# EasyEDA schematic AeroModule_2021-02-14.json

## Sheets
1 Sheet_1: TITLE: Sheet_1; REV: 1.0; Date: 2020-12-30; Sheet: 1/1; Drawn By: ron; Company: Your Company
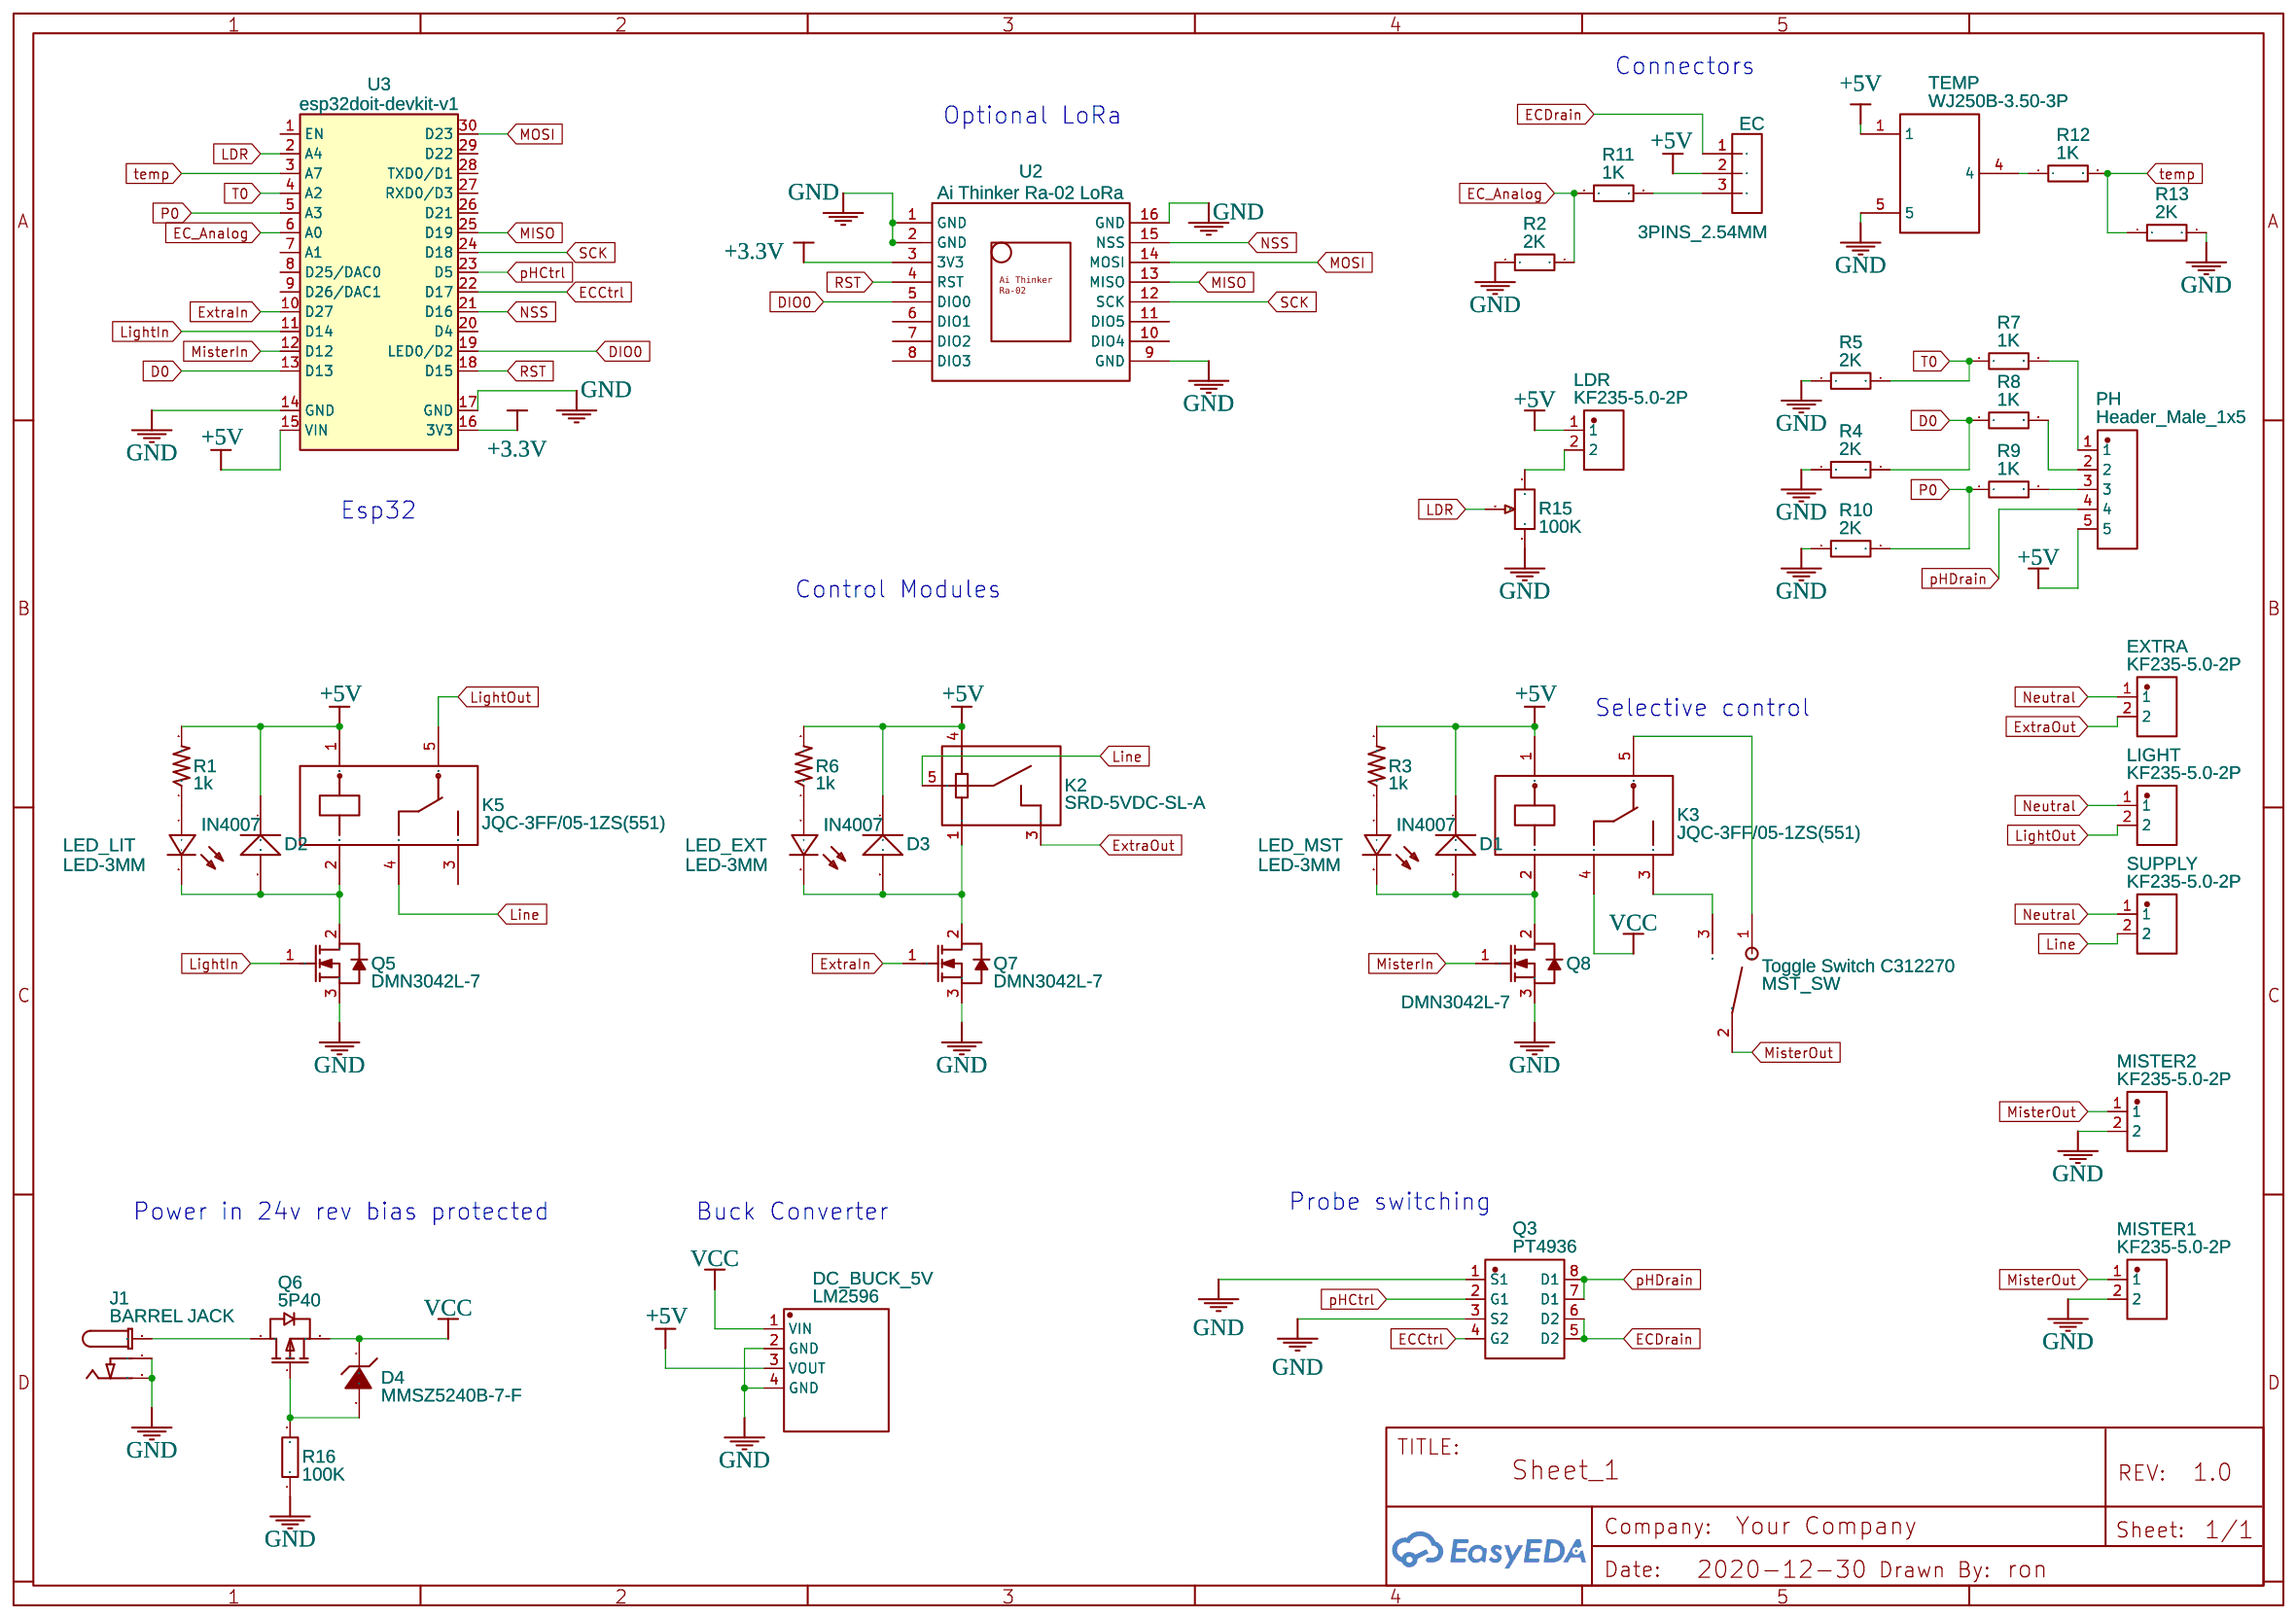
[diagram p0: Sheet_1]
2 Power: TITLE: Sheet_2; Date: 2021-02-05; Drawn By: myrods47
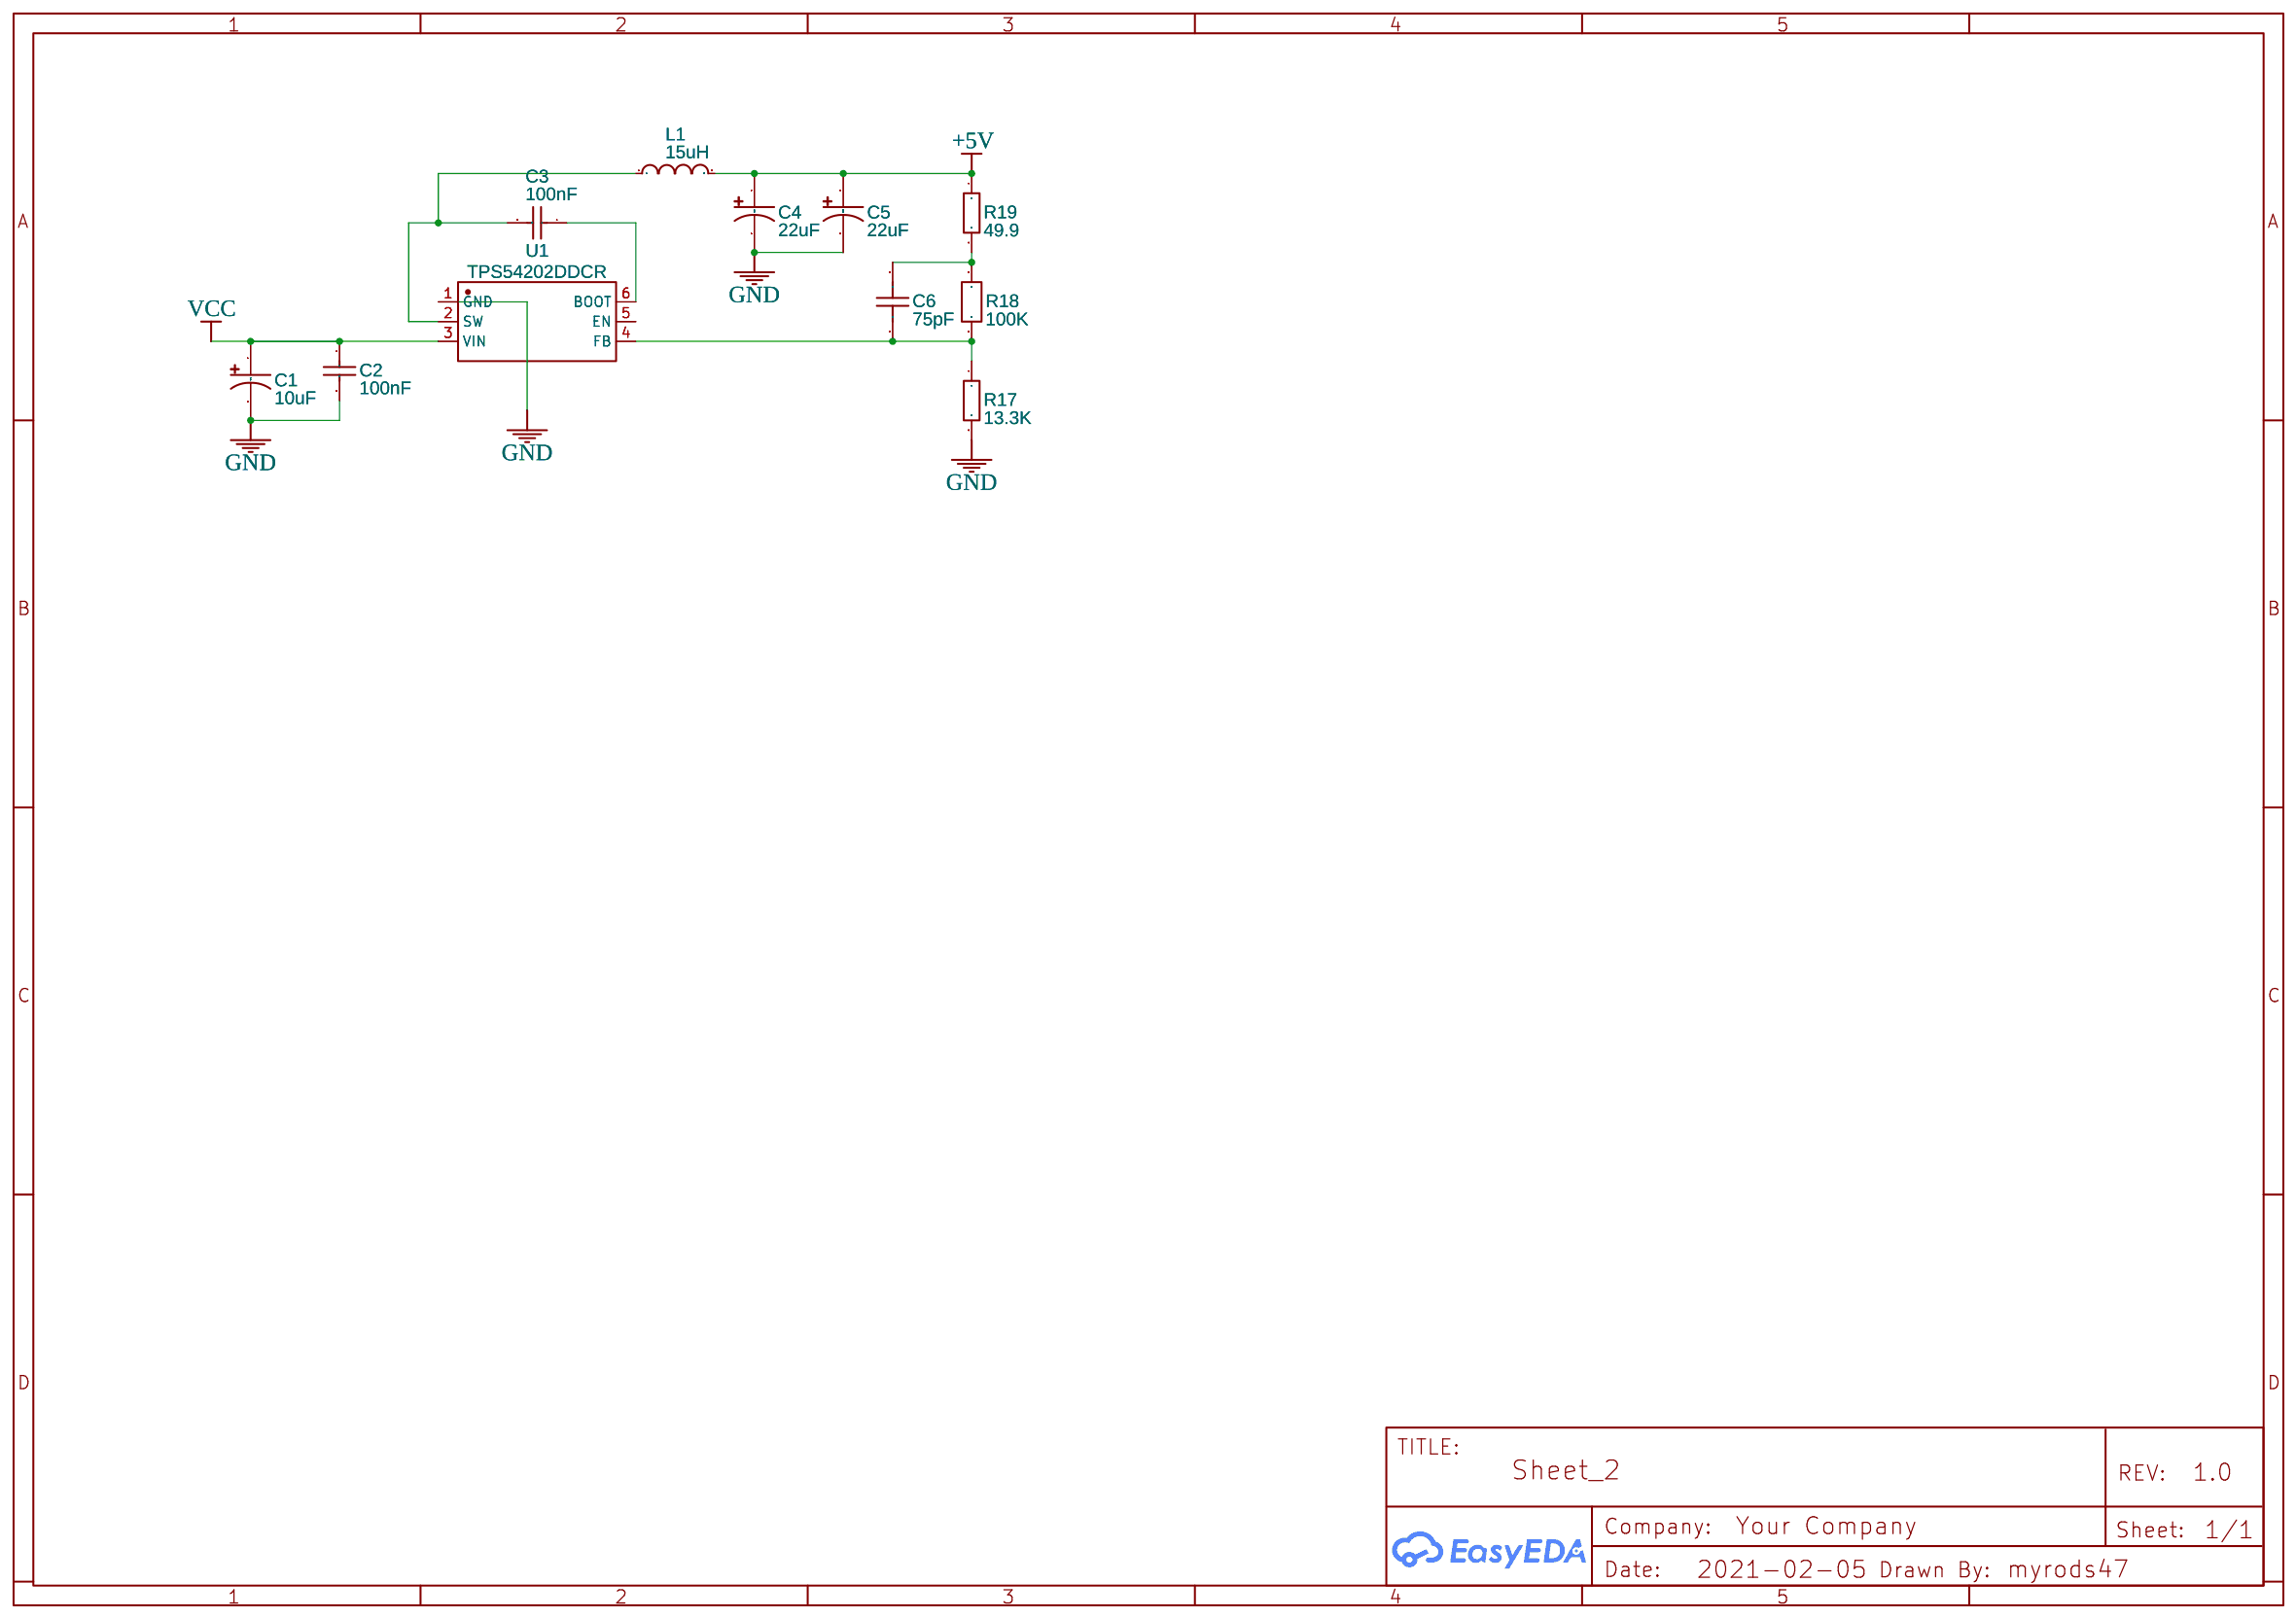
[diagram p1: Power]

## Parts
sheet Power
C1  10uF  [CAP-SMD_BD5.0-L5.3-W5.3-FD]
C2  100nF  [C1206]
C3  100nF  [C1206]
C4  22uF  [CAP-SMD_BD6.3-L6.6-W6.6-FD]
C5  22uF  [CAP-SMD_BD6.3-L6.6-W6.6-FD]
C6  75pF  [C0805]
L1  15uH  [IND-SMD_L5.0-W5.0_SWPA5040S]
R17  13.3K  [R1206]
R18  100K  [R1206]
R19  49.9  [R0805]
U1  TPS54202DDCR  [SOT-23-6_L2.9-W1.6-P0.95-LS2.8-BR]
sheet Sheet_1
D1  IN4007  [IN4007]
D2  IN4007  [IN4007]
D3  IN4007  [IN4007]
D4  MMSZ5240B-7-F  [SOD-123_L2.7-W1.6-LS3.7-RD]
DC_BUCK_5V  LM2596  [LM2596-MODULE]
EC  3PINS_2.54MM  [CONNECTOR - 3PIN]
EXTRA  KF235-5.0-2P  [CONN-TH_P5.00_KF235-5.0-2P]
J1  BARREL JACK  [DC_BARREL_JACK_PTH_2MM_2]
K2  SRD-5VDC-SL-A  [SRD-5VDC-SL-A]
K3  JQC-3FF/05-1ZS(551)  [RELAY-TH_HF3FF-XX-1ZXX-XXX]
K5  JQC-3FF/05-1ZS(551)  [RELAY-TH_HF3FF-XX-1ZXX-XXX]
LDR  KF235-5.0-2P  [CONN-TH_P5.00_KF235-5.0-2P]
LED_EXT  LED-3MM  [LED-3MM/2.54]
LED_LIT  LED-3MM  [LED-3MM/2.54]
LED_MST  LED-3MM  [LED-3MM/2.54]
LIGHT  KF235-5.0-2P  [CONN-TH_P5.00_KF235-5.0-2P]
MISTER1  KF235-5.0-2P  [CONN-TH_P5.00_KF235-5.0-2P]
MISTER2  KF235-5.0-2P  [CONN-TH_P5.00_KF235-5.0-2P]
MST_SW  Toggle Switch C312270  [TOGGLE SWITCH C312270]
PH  Header_Male_1x5  [PAD_1X5]
Q3  PT4936  [SOIC-8_L5.0-W4.0-P1.27-LS6.0-BL]
Q5  DMN3042L-7  [SOT-23-3_L2.9-W1.6-P1.90-LS2.8-BR-CW]
Q6  5P40  [SOT-23-3_L2.9-W1.6-P1.90-LS2.8-BR]
Q7  DMN3042L-7  [SOT-23-3_L2.9-W1.6-P1.90-LS2.8-BR-CW]
Q8  DMN3042L-7  [SOT-23-3_L2.9-W1.6-P1.90-LS2.8-BR-CW]
R1  1k  [1206]
R2  2K  [R1206]
R3  1k  [1206]
R4  2K  [R1206]
R5  2K  [R1206]
R6  1k  [1206]
R7  1K  [R1206]
R8  1K  [R1206]
R9  1K  [R1206]
R10  2K  [R1206]
R11  1K  [R1206]
R12  1K  [R1206]
R13  2K  [R1206]
R15  100K  [RES-ADJ-TH_3P-L9.5-W4.9-P2.50-L_3296W]
R16  100K  [R1206]
SUPPLY  KF235-5.0-2P  [CONN-TH_P5.00_KF235-5.0-2P]
TEMP  WJ250B-3.50-3P  [CONN-TH_3P-P3.50_WJ250B-3.50-3P]
U2  Ai Thinker Ra-02 LoRa  [AI THINKER RA-02 LORA]
U3  esp32doit-devkit-v1  [ESP32_DEVKIT_V1_DOIT]

## Library data of the parts
C1 = EEEHB1V100AR: Supplier: LCSC; Supplier Part: C336504; Manufacturer: PANASONIC; Contributor: LCSC
C2 C3 = CL31B104KBCNNNC: Supplier: LCSC; Manufacturer: SAMSUNG; Supplier Part: C24497; SMT Type: Basic; JLCPCB SMD: Yes; LCSC Assembly: Yes
C4 C5 = CK1V220M-CRE54: Supplier: LCSC; Supplier Part: C190079; Manufacturer: Semtech; Contributor: LCSC
C6 = CC0805JRNPO9BN750: Supplier: LCSC; Supplier Part: C113832; Manufacturer: YAGEO; Contributor: LCSC
L1 = CR5040-150M: Supplier: LCSC; Supplier Part: C520353; Manufacturer: Ceaiya; Contributor: LCSC
R17 = TR1206B13K3P0550: Supplier: LCSC; Supplier Part: C153316; Manufacturer: Ever Ohms Tech; Contributor: LCSC
R18 = TC0650F1003T5E: Supplier: LCSC; Supplier Part: C425571; Manufacturer: UNI-ROYAL(Uniroyal Elec); Contributor: LCSC
R19 = TC0525F499JT5E: Supplier: LCSC; Manufacturer: UniOhm; Supplier Part: C78599; SMT Type: Extend; JLCPCB SMD: Yes; LCSC Assembly: Yes
U1 = TPS54202DDCR: Supplier: LCSC; Supplier Part: C191884; Manufacturer: Texas Instruments; Contributor: LCSC; SMT Type: Extend; JLCPCB SMD: Yes; LCSC Assembly: Yes
D1-D3 = -: Manufacturer Part: IRFD9120PbF; Contributor: William Meade
D4 = MMSZ5240B-7-F: Supplier: LCSC; Manufacturer: DIODES; Contributor: LCSC; Supplier Part: C151060; SMT Type: Extend; JLCPCB SMD: Yes; LCSC Assembly: Yes
DC_BUCK_5V = LM2596
EC = 3PINS_2.54MM: Supplier Part: undefined; Contributor: fredj21
EXTRA LDR LIGHT MISTER1 MISTER2 SUPPLY = KF235-5.0-2P: Supplier: LCSC; Supplier Part: C475172; Manufacturer: Cixi Kefa Elec; Contributor: LCSC
J1 = BARREL JACK: Contributor: MarekB
K2 = -: Supplier: LCSC; Supplier Part: C140615; Manufacturer: Ningbo Songle Relay; Contributor: LCSC
K3 K5 = JQC-3FF/05-1ZS(551): Supplier: LCSC; Manufacturer: HF; image: //image.lceda.cn/szlcsc/C9221.jpg; Supplier Part: C9221; LCSC Assembly: Yes; SMT Type: Extend
LED_EXT LED_LIT LED_MST = -: Supplier: LCSC; Manufacturer: EVERLIGHT; Manufacturer Part: 204-10SURD/S530-A3; Supplier Part: C99772
MST_SW = Toggle Switch C312270: Manufacturer: YUEN FUNG; Manufacturer Part: ST-1-102-A01-T000-RS; Supplier: LCSC; Supplier Part: C312270; link: https://lcsc.com/product-detail/Toggle-Switches_YUEN-FUNG-ST-1-102-A01-T000-RS_C312270.html; Contributor: danielbland
PH = Header_Male_1x5: Contributor: Max500
Q3 = PT4936: Supplier: LCSC; Supplier Part: C479040; Manufacturer: PUOLOP; Contributor: LCSC
Q5 Q7 Q8 = DMN3042L-7: Supplier: LCSC; Supplier Part: C102621; Manufacturer: Diodes Incorporated; Contributor: LCSC; SMT Type: Extend; JLCPCB SMD: Yes; LCSC Assembly: Yes
Q6 = 5P40: Supplier: LCSC; Supplier Part: C239051; Manufacturer: GOFORD; Contributor: LCSC; SMT Type: Extend; JLCPCB SMD: Yes; LCSC Assembly: Yes
R1 R3 R6 = -: Contributor: SparkFun; Manufacturer Part: ?
R2 R4 R5 R10 R13 = ARG06FTC2001: Supplier: LCSC; Supplier Part: C294132; Manufacturer: Viking Tech; Contributor: LCSC
R7-R9 R11 R12 = ARG06FTC1001: Supplier: LCSC; Supplier Part: C294117; Manufacturer: Viking Tech; Contributor: LCSC
R15 = 3296W-1-104: Supplier: LCSC; Supplier Part: C118963; Manufacturer: Chengdu Guosheng Tech; Contributor: LCSC; LCSC Assembly: Yes; SMT Type: Extend
R16 = AR06FTCV1003: Supplier: LCSC; Supplier Part: C412413; Manufacturer: Viking Tech; Contributor: LCSC
TEMP = WJ250B-3.50-3P: Supplier: LCSC; Manufacturer: ReliaPro; image: //image.lceda.cn/szlcsc/C8420.jpg; Supplier Part: C8420; LCSC Assembly: Yes; SMT Type: Extend
U2 = Ai Thinker Ra-02 LoRa: Contributor: Fritz Keyzer
U3 = esp32_devkit_v1_doit_ESP32_DevKit_V1_DOIT: Contributor: EddyBeaupre

## Nets
+3.3V: U2.3(3V3) U3.16(3V3)
+5V: C4.1 C5.1 D1.1 D2.1 D3.1 DC_BUCK_5V.3(VOUT) EC.2 K2.4 K3.1 K5.1 L1.2 LDR.1 PH.5 R1.2 R3.2 R6.2 R19.1 TEMP.1 U3.15(VIN)
GND: C1.2 C2.2 C4.2 C5.2 DC_BUCK_5V.2(GND) DC_BUCK_5V.4(GND) J1.P2(P3) J1.P3(P2) MISTER1.2 MISTER2.2 Q3.1(S1) Q3.3(S2) Q5.3(S) Q7.3(S) Q8.3(S) R2.1 R4.1 R5.1 R10.1 R13.2 R15.1 R16.1 R17.2 TEMP.5 U1.1(GND) U2.1(GND) U2.2(GND) U2.9(GND) U2.16(GND) U3.14(GND) U3.17(GND)
VCC: C1.1 C2.1 D4.1(K) DC_BUCK_5V.1(VIN) K3.4 Q6.2(S) U1.3(VIN)
D0: R4.2 R8.1 U3.13(D13)
DIO0: U2.5(DIO0) U3.19(LED0/D2)
EC_Analog: R2.2 R11.1 U3.6(A0)
ECCtrl: Q3.4(G2) U3.22(D17)
ECDrain: EC.1 Q3.5(D2) Q3.6(D2)
ExtraIn: Q7.1(G) U3.10(D27)
ExtraOut: EXTRA.2 K2.3
LDR: R15.2 U3.2(A4)
LightIn: Q5.1(G) U3.11(D14)
LightOut: K5.5 LIGHT.2
Line: K2.5 K5.4 SUPPLY.2
MISO: U2.13(MISO) U3.25(D19)
MisterIn: Q8.1(G) U3.12(D12)
MisterOut: MISTER1.1 MISTER2.1 MST_SW.2
MOSI: U2.14(MOSI) U3.30(D23)
Neutral: EXTRA.1 LIGHT.1 SUPPLY.1
NSS: U2.15(NSS) U3.21(D16)
P0: R9.1 R10.2 U3.5(A3)
pHCtrl: Q3.2(G1) U3.23(D5)
pHDrain: PH.4 Q3.7(D1) Q3.8(D1)
RST: U2.4(RST) U3.18(D15)
SCK: U2.12(SCK) U3.24(D18)
T0: R5.2 R7.1 U3.4(A2)
temp: R12.2 R13.1 U3.3(A7)
Net-(C3-1): C3.1 U1.6(BOOT)
Net-(C3-2): C3.2 L1.1 U1.2(SW)
Net-(C6-1): C6.1 R17.1 R18.2 U1.4(FB)
Net-(C6-2): C6.2 R18.1 R19.2
Net-(D1-2): D1.2 K3.2 LED_MST.2(-) Q8.2(D)
Net-(D2-2): D2.2 K5.2 LED_LIT.2(-) Q5.2(D)
Net-(D3-2): D3.2 K2.1 LED_EXT.2(-) Q7.2(D)
Net-(D4-2): D4.2(A) Q6.1(G) R16.2
Net-(EC-3): EC.3 R11.2
Net-(J1-P1): J1.P1 Q6.3(D)
Net-(K3-3): K3.3 MST_SW.3
Net-(K3-5): K3.5 MST_SW.1
Net-(LDR-2): LDR.2 R15.3
Net-(LED_EXT-1): LED_EXT.1(+) R6.1
Net-(LED_LIT-1): LED_LIT.1(+) R1.1
Net-(LED_MST-1): LED_MST.1(+) R3.1
Net-(PH-1): PH.1 R7.2
Net-(PH-2): PH.2 R8.2
Net-(PH-3): PH.3 R9.2
Net-(R12-1): R12.1 TEMP.4

Not connected (* = marked no-connect by the designer): K5 3; U1 5(EN); U2 6(DIO1) 7(DIO2) 8(DIO3) 10(DIO4) 11(DIO5); U3 1(EN) 7(A1) 8(D25/DAC0) 9(D26/DAC1) 20(D4) 26(D21) 27(RXD0/D3) 28(TXD0/D1) 29(D22)

## Notes on the sheets
sheet 1
- Connectors
- Optional LoRa
- Esp32
- Control Modules
- Selective control
- Probe switching
- Power in 24v rev bias protected
- Buck Converter
